# Altium project T20_DevBoard.PrjPcb (part 4 of 4)

## Sheet CONFIGURATION_STORAGE_USER_LEDS_BUTTONS.SchDoc: CONFIGURATION_&_STORAGE_&_USER_LEDS_BUTTONS
size 420 x 297 mm; DrawnBy: Orhun Dabak; Revision: 1.0; SheetNumber: 6; SheetTotal: 7
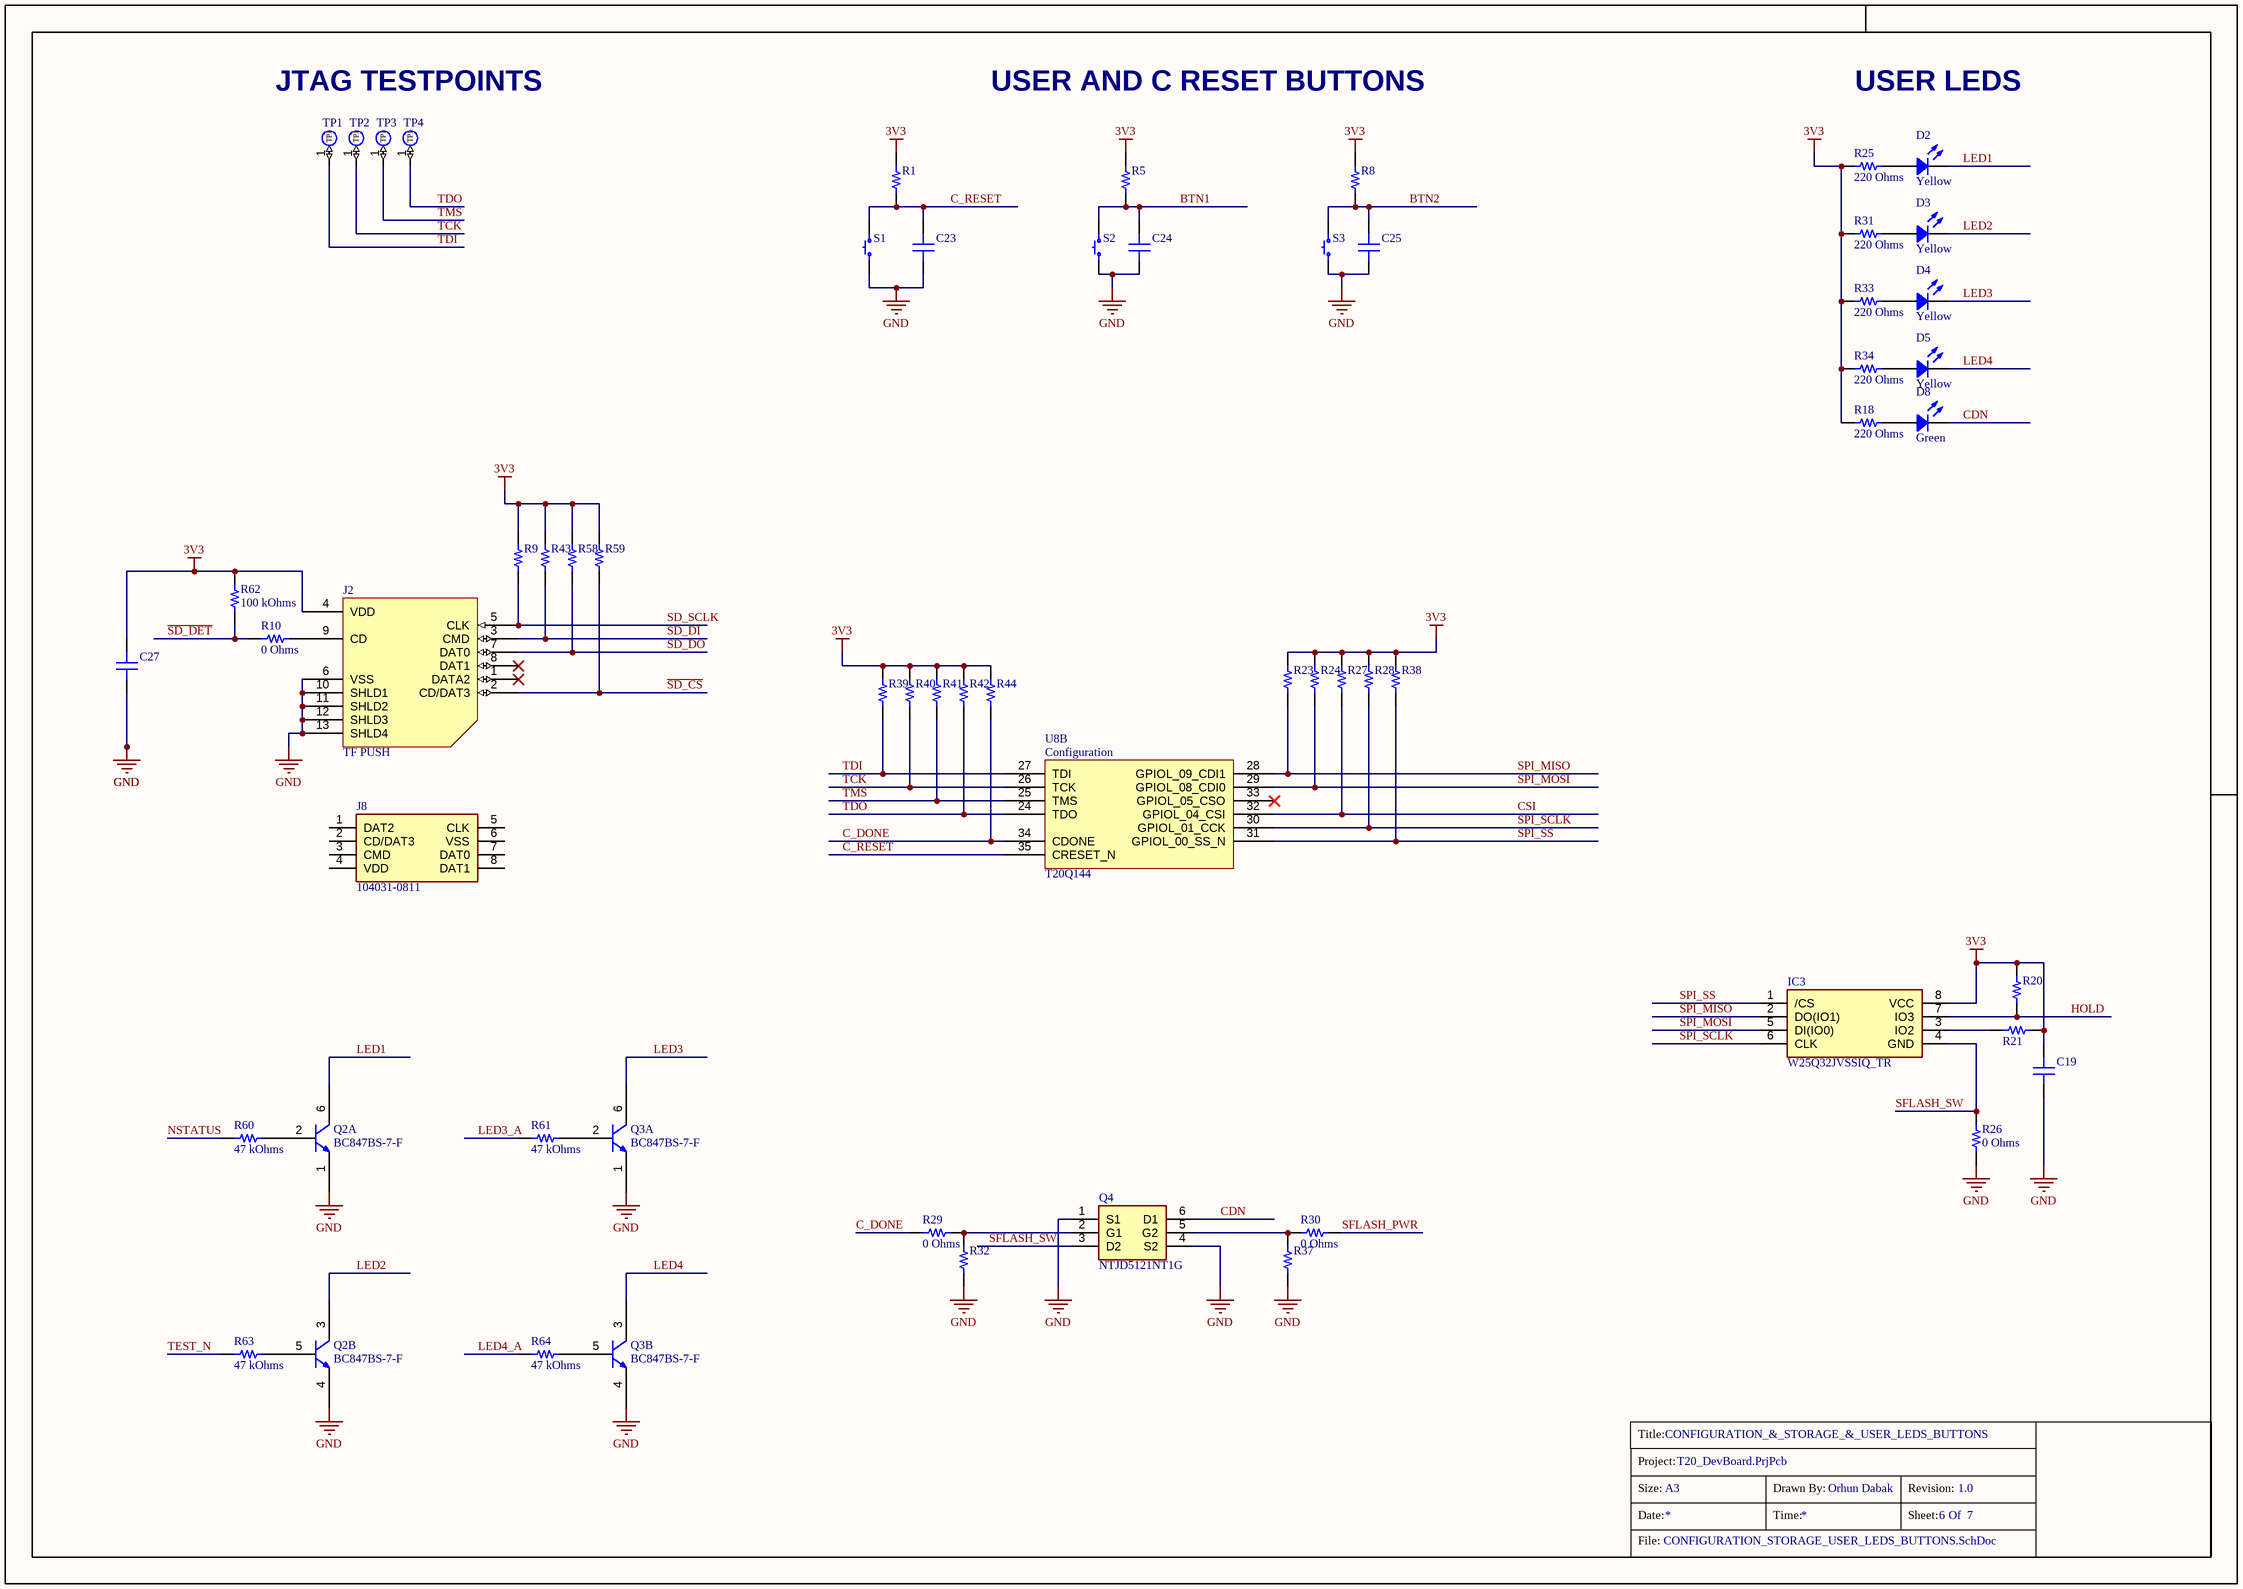
[diagram p5: CONFIGURATION_STORAGE_USER_LEDS_BUTTONS.SchDoc]

### Parts
(Parts that share a designator on the sheet are numbered #1, #2 ... from top to bottom, then left to right.)
?#5  (no value)  (graphical)
C19  0.1 µF  [CAP 0402_1005]  (value not drawn)
C23  10 µF  [CAP 0402_1005]  (value not drawn)
C24  10 µF  [CAP 0402_1005]  (value not drawn)
C25  10 µF  [CAP 0402_1005]  (value not drawn)
C27  0.1 µF  [CAP 0402_1005]  (value not drawn)
D2  Yellow  [LED 0603_1608 YELLOW]
D3  Yellow  [LED 0603_1608 YELLOW]
D4  Yellow  [LED 0603_1608 YELLOW]
D5  Yellow  [LED 0603_1608 YELLOW]
D8  Green  [LED 0603_1608 GREEN]
IC3  W25Q32JVSSIQ_TR  [SOIC127P790X216-8N]
J2  TF PUSH  [TF PUSH]
J8  104031-0811  [1040310811]
Q2  BC847BS-7-F  [BC847BS-7-F-Footprint-1]  (parts A,B of 2)
Q3  BC847BS-7-F  [BC847BS-7-F-Footprint-1]  (parts A,B of 2)
Q4  NTJD5121NT1G  [SOT65P210X110-6N]
R1  10 kOhms  [RES 0402_1005]  (value not drawn)
R5  10 kOhms  [RES 0402_1005]  (value not drawn)
R8  10 kOhms  [RES 0402_1005]  (value not drawn)
R9  10 kOhms  [RES 0402_1005]  (value not drawn)
R10  0 Ohms  [RES 0402_1005]
R18  220 Ohms  [RES 0402_1005]
R20  10 kOhms  [RES 0402_1005]  (value not drawn)
R21  10 kOhms  [RES 0402_1005]  (value not drawn)
R23  10 kOhms  [RES 0402_1005]  (value not drawn)
R24  10 kOhms  [RES 0402_1005]  (value not drawn)
R25  220 Ohms  [RES 0402_1005]
R26  0 Ohms  [RES 0402_1005]
R27  10 kOhms  [RES 0402_1005]  (value not drawn)
R28  10 kOhms  [RES 0402_1005]  (value not drawn)
R29  0 Ohms  [RES 0402_1005]
R30  0 Ohms  [RES 0402_1005]
R31  220 Ohms  [RES 0402_1005]
R32  10 kOhms  [RES 0402_1005]  (value not drawn)
R33  220 Ohms  [RES 0402_1005]
R34  220 Ohms  [RES 0402_1005]
R37  10 kOhms  [RES 0402_1005]  (value not drawn)
R38  10 kOhms  [RES 0402_1005]  (value not drawn)
R39  10 kOhms  [RES 0402_1005]  (value not drawn)
R40  10 kOhms  [RES 0402_1005]  (value not drawn)
R41  10 kOhms  [RES 0402_1005]  (value not drawn)
R42  10 kOhms  [RES 0402_1005]  (value not drawn)
R43  10 kOhms  [RES 0402_1005]  (value not drawn)
R44  10 kOhms  [RES 0402_1005]  (value not drawn)
R58  10 kOhms  [RES 0402_1005]  (value not drawn)
R59  10 kOhms  [RES 0402_1005]  (value not drawn)
R60  47 kOhms  [RES 0402_1005]
R61  47 kOhms  [RES 0402_1005]
R62  100 kOhms  [RES 0402_1005]
R63  47 kOhms  [RES 0402_1005]
R64  47 kOhms  [RES 0402_1005]
S1  TS342A2P-WZ  [TS342A2P-WZ]  (value not drawn)
S2  TS342A2P-WZ  [TS342A2P-WZ]  (value not drawn)
S3  TS342A2P-WZ  [TS342A2P-WZ]  (value not drawn)
TP1  TP_1  [TEST POINT]  (value not drawn)  (no BOM)
TP2  TP_1  [TEST POINT]  (value not drawn)  (no BOM)
TP3  TP_1  [TEST POINT]  (value not drawn)  (no BOM)
TP4  TP_1  [TEST POINT]  (value not drawn)  (no BOM)
U8  T20Q144  [CQFP50P2200X2200X160-144N]  (part B of 13)

### Nets
3V3: C19.2 C27.2 IC3.8(VCC) J2.4(VDD) R1.2 R5.2 R8.2 R9.2 R18.1 R20.2 R21.1 R23.2 R24.2 R25.1 R27.2 R28.2 R31.1 R33.1 R34.1 R38.2 R39.2 R40.2 R41.2 R42.2 R43.2 R44.2 R58.2 R59.2 R62.2
GND: C19.1 C23.1 C24.1 C25.1 C27.1 J2.6(VSS) J2.10(SHLD1) J2.11(SHLD2) J2.12(SHLD3) J2.13(SHLD4) Q2.1(Emitter) Q2.4(Emitter) Q3.1(Emitter) Q3.4(Emitter) Q4.1(S1) Q4.4(S2) R26.1 R32.1 R37.1 S1.1 S2.1 S3.1
BTN1: C24.2 R5.1 S2.2
BTN2: C25.2 R8.1 S3.2
C_DONE: R29.1 R44.1 U8.34(CDONE)
C_RESET: C23.2 R1.1 S1.2 U8.35(CRESET_N)
CDN: D8.2 Q4.6(D1)
CSI: R27.1 U8.32(GPIOL_04_CSI)
HOLD: IC3.7(IO3) R20.1
LED1: D2.2 Q2.6(Collector)
LED2: D3.2 Q2.3(Collector)
LED3: D4.2 Q3.6(Collector)
LED3_A: R61.1
LED4: D5.2 Q3.3(Collector)
LED4_A: R64.1
NSTATUS: R60.1
~{SD_CS}: J2.2(CD/DAT3) R59.1
~{SD_DET}: R10.1 R62.1
SD_DI: J2.3(CMD) R43.1
SD_DO: J2.7(DAT0) R58.1
SD_SCLK: J2.5(CLK) R9.1
SFLASH_PWR: R30.2
SFLASH_SW: IC3.4(GND) Q4.3(D2) R26.2
SPI_MISO: IC3.2(DO(IO1)) R23.1 U8.28(GPIOL_09_CDI1)
SPI_MOSI: IC3.5(DI(IO0)) R24.1 U8.29(GPIOL_08_CDI0)
SPI_SCLK: IC3.6(CLK) R28.1 U8.30(GPIOL_01_CCK)
SPI_SS: IC3.1(/CS) R38.1 U8.31(GPIOL_00_SS_N)
TCK: R40.1 TP2.1(TP1) U8.26(TCK)
TDI: R39.1 TP1.1(TP1) U8.27(TDI)
TDO: R42.1 TP4.1(TP1) U8.24(TDO)
TEST_N: R63.1
TMS: R41.1 TP3.1(TP1) U8.25(TMS)
NetD2_1: D2.1 R25.2
NetD3_1: D3.1 R31.2
NetD4_1: D4.1 R33.2
NetD5_1: D5.1 R34.2
NetD8_1: D8.1 R18.2
NetIC3_3: IC3.3(IO2) R21.2
NetJ2_9: J2.9(CD) R10.2
NetQ2_2: Q2.2(Base) R60.2
NetQ2_5: Q2.5(Base) R63.2
NetQ3_2: Q3.2(Base) R61.2
NetQ3_5: Q3.5(Base) R64.2
NetQ4_2: Q4.2(G1) R29.2 R32.2
NetQ4_5: Q4.5(G2) R30.1 R37.2

Not connected (* = marked no-connect by the designer): J2 1(DATA2)* 8(DAT1)*; J8 1(DAT2) 2(CD/DAT3) 3(CMD) 4(VDD) 5(CLK) 6(VSS) 7(DAT0) 8(DAT1); U8 33(GPIOL_05_CSO)*

### Notes on the sheet
- JTAG TESTPOINTS
- USER AND C RESET BUTTONS
- USER LEDS
- Title:
- Project:
- Size:
- Date:
- File:
- A3
- Time:
- Drawn By:
- Sheet:
- Revision:
- Of
- (in symbol T20Q144, part B) Configuration

### Library data of the parts
?#5 = Title_Block
C19 C27 = CC0402KRX7R6BB104: CAP CER 0.1UF 10V X7R 0402; manufacturer: Yageo; Tolerance: ±10%; Part Number: CC0402KRX7R6BB104; Value: 0.1 µF; Applications: General Purpose; Capacitance: 0.1 µF; componentlink1description: Datasheet; componentlink1url: https://www.yageo.com/upload/media/product/productsearch/datasheet/mlcc/UPY-GPHC_X7R_6.3V-to-50V_18.pdf; componentlink2description: DigiKey Link; componentlink2url: https://www.digikey.com/en/products/detail/yageo/CC0402KRX7R6BB104/2103083; Device Package: 0402 (1005 Metric); lastupdated: 19/09/2022 12:57:28; Lifecycle Status: Active; Minimum Order: 1; Mounting Type: Surface Mount, MLCC; Operating Temperature: -55°C ~ 125°C; Package / Case: 0402 (1005 Metric); packaging: CutTape; partid: 3877; Part Status: Active; price: 0.01; series: CC; Size / Dimension: 0.039" L x 0.020" W (1.00mm x 0.50mm); Supplier 1: DigiKey; Supplier Part Number 1: 311-1345-1-ND; Temperature Coefficient: X7R; Thickness (Max): 0.022" (0.55mm); Voltage - Rated: 10V
C23-C25 = GRM155R61A106ME11D: CAP CER 10UF 10V X5R 0402; manufacturer: Murata Electronics; Tolerance: ±20%; Part Number: GRM155R61A106ME11D; Value: 10 µF; Applications: General Purpose; Capacitance: 10 µF; componentlink2description: DigiKey Link; componentlink2url: https://www.digikey.com/en/products/detail/murata-electronics/GRM155R61A106ME11D/12091056; Device Package: 0402 (1005 Metric); lastupdated: 19/09/2022 12:56:37; Lifecycle Status: Active; Minimum Order: 1; Mounting Type: Surface Mount, MLCC; Operating Temperature: -55°C ~ 85°C; Package / Case: 0402 (1005 Metric); packaging: TapeAndReel; partid: 45464; Part Status: Active; price: 0.02; series: GRM; Size / Dimension: 0.039" L x 0.020" W (1.00mm x 0.50mm); Supplier 1: DigiKey; Supplier Part Number 1: 490-GRM155R61A106ME11DCT-ND; Temperature Coefficient: X5R; Thickness (Max): 0.028" (0.70mm); Voltage - Rated: 10V
D2-D5 = SML-LX0603YW-TR: LED YELLOW DIFFUSED SMD; Manufacturer: Lumex Opto/Components Inc.; Configuration: Standard; Current - Test: 20mA; Lens Color: White; Lens Size: 1.00mm x 0.80mm; Lens Style: Rectangle with Flat Top; Millicandela Rating: 14mcd; Viewing Angle: 160°; Voltage - Forward (Vf) (Typ): 2.1V; Wavelength - Peak: 585nm; Part Number: SML-LX0603YW-TR; Color: Yellow; ComponentLink1Description: Datasheet; ComponentLink1URL: https://www.lumex.com/content/files/ProductAttachment/SML-LX0603YW-TR.pdf; ComponentLink2Description: DigiKey Link; ComponentLink2URL: https://www.digikey.com/en/products/detail/lumex-opto-components-inc/SML-LX0603YW-TR/304361; Device Package: 0603 (1608 Metric); Height (Max): 0.60mm; LastUpdated: 19/09/2022 13:51:05; Lens Transparency: Diffused; Lifecycle Status: Active; Minimum Order: 1; Mounting Type: Surface Mount; Package / Case: 0603 (1608 Metric); Packaging: TapeAndReel; PartId: 92; Part Status: Active; Price: 0.05; Series: -; Size / Dimension: 1.60mm L x 0.80mm W; Supplier 1: DigiKey; Supplier Part Number 1: 67-1550-1-ND; Value: Yellow
D8 = LSM0603453V: LED SM 0603 3V -/1000/-MCD GREEN; Manufacturer: Visual Communications Company - VCC; Configuration: Standard; Current - Test: 20mA; Lens Color: Colorless; Lens Size: 1.20mm x 0.80mm; Lens Style: Rectangle with Flat Top; Lens Transparency: Clear; Millicandela Rating: 63mcd; Viewing Angle: 120°; Voltage - Forward (Vf) (Typ): 2V; Wavelength - Dominant: 572nm; Wavelength - Peak: 571nm; Part Number: LSM0603453V; Color: Green; ComponentLink1Description: Datasheet; ComponentLink1URL: https://vcclite.com/wp-content/uploads/wpallimport/files/files/LSM0603453V.pdf; ComponentLink2Description: DigiKey Link; ComponentLink2URL: https://www.digikey.com/en/products/detail/visual-communications-company-vcc/LSM0603453V/9486724; Device Package: 0603 (1608 Metric); Height (Max): 0.65mm; LastUpdated: 19/09/2022 13:49:59; Lifecycle Status: Active; Minimum Order: 1; Mounting Type: Surface Mount; Package / Case: 0603 (1608 Metric); Packaging: TapeAndReel; PartId: 579; Part Status: Active; Price: 0.05; Series: LSM0603; Size / Dimension: 1.60mm L x 0.80mm W; Supplier 1: DigiKey; Supplier Part Number 1: LSM0603453VCT-ND; Supplier Device Package: Chip LED; Value: Green
IC3 = W25Q32JVSSIQ_TR: Integrated Circuit; Manufacturer_Name: Winbond; Manufacturer_Part_Number: W25Q32JVSSIQ TR; Datasheet Link: https://www.winbond.com/resource-files/w25q32jv%20spi%20revc%2008302016.pdf; Height: 2.16mm; Mouser Part Number: 454-W25Q32JVSSIQTR; Mouser Price/Stock: https://www.mouser.co.uk/ProductDetail/Winbond/W25Q32JVSSIQ-TR?qs=qSfuJ%252Bfl%2Fd73AdQzQa%2FEuA%3D%3D; Arrow Part Number: W25Q32JVSSIQ TR; Arrow Price/Stock: https://www.arrow.com/en/products/w25q32jvssiqtr/winbond-electronics?region=nac
J2 = TF PUSH: -20℃~+90℃ 2mm Deck MicroSD card (TF card) Self bomb SMD SD Card Connectors ROHS; Manufacturer: SHOU HAN; ComponentLink1Description: Datasheet; ComponentLink1URL: https://datasheet.lcsc.com/lcsc/1912111437_SHOU-HAN-TF-PUSH_C393941.pdf; ComponentLink2Description: LCSC Link; ComponentLink2URL: https://www.lcsc.com/product-detail/SD-Card-Connectors_SHOU-HAN-TF-PUSH_C393941.html; Manufacturer Part Number: TF PUSH; LCSC Part Number: C393941; Package: SMD; Category: Connectors/SD Card Connectors; Operating Temperature Range: -20℃~+90℃; Maximum Body Height: 2mm; Connector Type: Deck; Card Type: MicroSD card (TF card); Card Connection Mode: Self bomb
J8 = 104031-0811: Connector; Manufacturer_Name: Molex; Datasheet Link: http://www.molex.com/webdocs/datasheets/pdf/en-us/1040310811_MEMORY_CARD_SOCKET.pdf; Manufacturer_Part_Number: 104031-0811; Mouser Part Number: 538-104031-0811; Mouser Price/Stock: https://www.mouser.co.uk/ProductDetail/Molex/104031-0811?qs=udsGRKD4nA3Tvy7wqky%252BuA%3D%3D
Q2 Q3 = CMP-013-00035-3: 2NPN Ic=100mA Vceo=45V hfe=200~450 P=200mW SOT363
Q4 = NTJD5121NT1G: Transistor; Manufacturer_Name: onsemi; Datasheet Link: http://www.onsemi.com/pub/Collateral/NTJD5121N-D.PDF; Height: 1.1mm; Manufacturer_Part_Number: NTJD5121NT1G; Mouser Part Number: 863-NTJD5121NT1G; Mouser Price/Stock: https://www.mouser.co.uk/ProductDetail/onsemi/NTJD5121NT1G?qs=E94NKttrCwxgtZwNB18zeg%3D%3D; Arrow Part Number: NTJD5121NT1G; Arrow Price/Stock: https://www.arrow.com/en/products/ntjd5121nt1g/on-semiconductor?region=nac
R1 R5 R8 R9 R20 R21 R23 R24 R27 R28 R32 R37-R44 R58 R59 = RP73PF1E10KBTD: RES 10K OHM 0.1% 1/10W 0402; Manufacturer: TE Connectivity Passive Product; Power (Watts): 0.1W, 1/10W; Temperature Coefficient: ±25ppm/°C; Part Number: RP73PF1E10KBTD; Value: 10 kOhms; ComponentLink1Description: Datasheet; ComponentLink1URL: https://www.te.com/commerce/DocumentDelivery/DDEController?Action=srchrtrv&DocNm=1773272&DocType=DS&DocLang=English; ComponentLink2Description: DigiKey Link; ComponentLink2URL: https://www.digikey.com/en/products/detail/te-connectivity-passive-product/RP73PF1E10KBTD/8260957; Composition: Thin Film; Device Package: 0402 (1005 Metric); Height - Seated (Max): 0.014" (0.35mm); LastUpdated: 9/19/2022 01:15:04 PM; Lifecycle Status: Active; Minimum Order: 1; Number of Terminations: 2; Operating Temperature: -55°C ~ 155°C; Package / Case: 0402 (1005 Metric); Packaging: TapeAndReel; PartId: 2434; Part Status: Active; Price: 0.09; Resistance: 10 kOhms; Series: RP73, Holsworthy; Size / Dimension: 0.039" L x 0.020" W (1.00mm x 0.50mm); Supplier 1: DigiKey; Supplier Part Number 1: A127415CT-ND; Supplier Device Package: 0402; Tolerance: ±0.1%
R10 R26 R29 R30 = RC0402JR-070RL: RES 0 OHM JUMPER 1/16W 0402; Manufacturer: Yageo; Power (Watts): 0.063W, 1/16W; Part Number: RC0402JR-070RL; Value: 0 Ohms; ComponentLink1Description: Datasheet; ComponentLink1URL: https://www.yageo.com/upload/media/product/productsearch/datasheet/rchip/PYu-RC_Group_51_RoHS_L_10.pdf; ComponentLink2Description: DigiKey Link; ComponentLink2URL: https://www.digikey.com/en/products/detail/yageo/RC0402JR-070RL/726406; Composition: Thick Film; Device Package: 0402 (1005 Metric); Features: Moisture Resistant; Height - Seated (Max): 0.016" (0.40mm); LastUpdated: 1/2/2023 08:20:46 PM; Lifecycle Status: Active; Minimum Order: 1; Number of Terminations: 2; Operating Temperature: -55°C ~ 155°C; Package / Case: 0402 (1005 Metric); Packaging: CutTape; PartId: 17588; Part Status: Active; Price: 0.01; Resistance: 0 Ohms; Series: RC_L; Size / Dimension: 0.039" L x 0.020" W (1.00mm x 0.50mm); Supplier 1: DigiKey; Supplier Part Number 1: 311-0.0JRCT-ND; Supplier Device Package: 0402; Tolerance: Jumper
R18 R25 R31 R33 R34 = RC0402FR-07220RL: RES 220 OHM 1% 1/16W 0402; Manufacturer: Yageo; Power (Watts): 0.063W, 1/16W; Temperature Coefficient: ±100ppm/°C; Part Number: RC0402FR-07220RL; Value: 220 Ohms; ComponentLink1Description: Datasheet; ComponentLink1URL: https://www.yageo.com/upload/media/product/productsearch/datasheet/rchip/PYu-RC_Group_51_RoHS_L_10.pdf; ComponentLink2Description: DigiKey Link; ComponentLink2URL: https://www.digikey.com/en/products/detail/yageo/RC0402FR-07220RL/726565; Composition: Thick Film; Device Package: 0402 (1005 Metric); Features: Moisture Resistant; Height - Seated (Max): 0.016" (0.40mm); LastUpdated: 19/09/2022 13:14:14; Lifecycle Status: Active; Minimum Order: 1; Number of Terminations: 2; Operating Temperature: -55°C ~ 155°C; Package / Case: 0402 (1005 Metric); Packaging: CutTape; PartId: 17956; Part Status: Active; Price: 0.01; Resistance: 220 Ohms; Series: RC_L; Size / Dimension: 0.039" L x 0.020" W (1.00mm x 0.50mm); Supplier 1: DigiKey; Supplier Part Number 1: 311-220LRCT-ND; Supplier Device Package: 0402; Tolerance: ±1%
R60 R61 R63 R64 = RMCF0402FT47K0: RES 47K OHM 1% 1/16W 0402; Manufacturer: Stackpole Electronics Inc; Power (Watts): 0.063W, 1/16W; Temperature Coefficient: ±100ppm/°C; Part Number: RMCF0402FT47K0; Value: 47 kOhms; ComponentLink1Description: Datasheet; ComponentLink1URL: https://www.seielect.com/catalog/sei-rmcf_rmcp.pdf; ComponentLink2Description: DigiKey Link; ComponentLink2URL: https://www.digikey.com/en/products/detail/stackpole-electronics-inc/RMCF0402FT47K0/1714749; Composition: Thick Film; Device Package: 0402 (1005 Metric); Features: Automotive AEC-Q200; Height - Seated (Max): 0.016" (0.40mm); LastUpdated: 1/2/2023 08:21:41 PM; Lifecycle Status: Active; Minimum Order: 1; Number of Terminations: 2; Operating Temperature: -55°C ~ 155°C; Package / Case: 0402 (1005 Metric); Packaging: CutTape; PartId: 4957; Part Status: Active; Price: 0.01; Ratings: AEC-Q200; Resistance: 47 kOhms; Series: RMCF; Size / Dimension: 0.039" L x 0.020" W (1.00mm x 0.50mm); Supplier 1: DigiKey; Supplier Part Number 1: RMCF0402FT47K0CT-ND; Supplier Device Package: 0402; Tolerance: ±1%
R62 = RT0402FRE07100KL: RES SMD 100K OHM 1% 1/16W 0402; Manufacturer: Yageo; Power (Watts): 0.063W, 1/16W; Temperature Coefficient: ±50ppm/°C; Part Number: RT0402FRE07100KL; Value: 100 kOhms; ComponentLink1Description: Datasheet; ComponentLink1URL: https://www.yageo.com/upload/media/product/productsearch/datasheet/rchip/PYu-RT_1-to-0.01_RoHS_L_11.pdf; ComponentLink2Description: DigiKey Link; ComponentLink2URL: https://www.digikey.com/en/products/detail/yageo/RT0402FRE07100KL/1071698; Composition: Thin Film; Device Package: 0402 (1005 Metric); Height - Seated (Max): 0.014" (0.35mm); LastUpdated: 1/2/2023 08:21:49 PM; Lifecycle Status: Active; Minimum Order: 1; Number of Terminations: 2; Operating Temperature: -55°C ~ 155°C; Package / Case: 0402 (1005 Metric); Packaging: TapeAndReel; PartId: 3190; Part Status: Active; Price: 0.01; Resistance: 100 kOhms; Series: RT; Size / Dimension: 0.039" L x 0.020" W (1.00mm x 0.50mm); Supplier 1: DigiKey; Supplier Part Number 1: YAG2307CT-ND; Supplier Device Package: 0402; Tolerance: ±1%
S1-S3 = TS342A2P-WZ: NO SMDSplicing 50mA 3.95mm 100MΩ 30000 12V 2.9mm -25℃~+70℃ 2mm Black Round Button Brick nogging SPST SMD Tactile Switches ROHS; Manufacturer: SHOU HAN; Mechanical Life: 30000; ComponentLink1Description: Datasheet; ComponentLink1URL: https://datasheet.lcsc.com/lcsc/2005221232_SHOU-HAN-TS342A2P-WZ_C557591.pdf; ComponentLink2Description: LCSC Link; ComponentLink2URL: https://www.lcsc.com/product-detail/Tactile-Switches_SHOU-HAN-TS342A2P-WZ_C557591.html; Manufacturer Part Number: TS342A2P-WZ; JLCPCB Part Number: C557591; Package: SMD; Contact Current: 50mA; Switch Length: 3.95mm; Insulation Resistance: 100MΩ; Voltage Rating (DC): 12V; Switch Width: 2.9mm; Actuator/Cap Color: Black; Actuator Style: Round Button; Mounting Style: Brick nogging; Circuit: SPST
TP1-TP4 = TEST POINT_1(I/O): 1.5x1.5mm Test Point(I/O)
U8 = T20Q144: Trion® Field Programmable Gate Array (FPGA) IC 97 1044 19728 144-LQFP

## Sheet FPGA_GPIO.SchDoc: ARDUINO_SYZGY
size 420 x 297 mm; DrawnBy: Orhun Dabak; Revision: 1.0; SheetNumber: 7; SheetTotal: 7
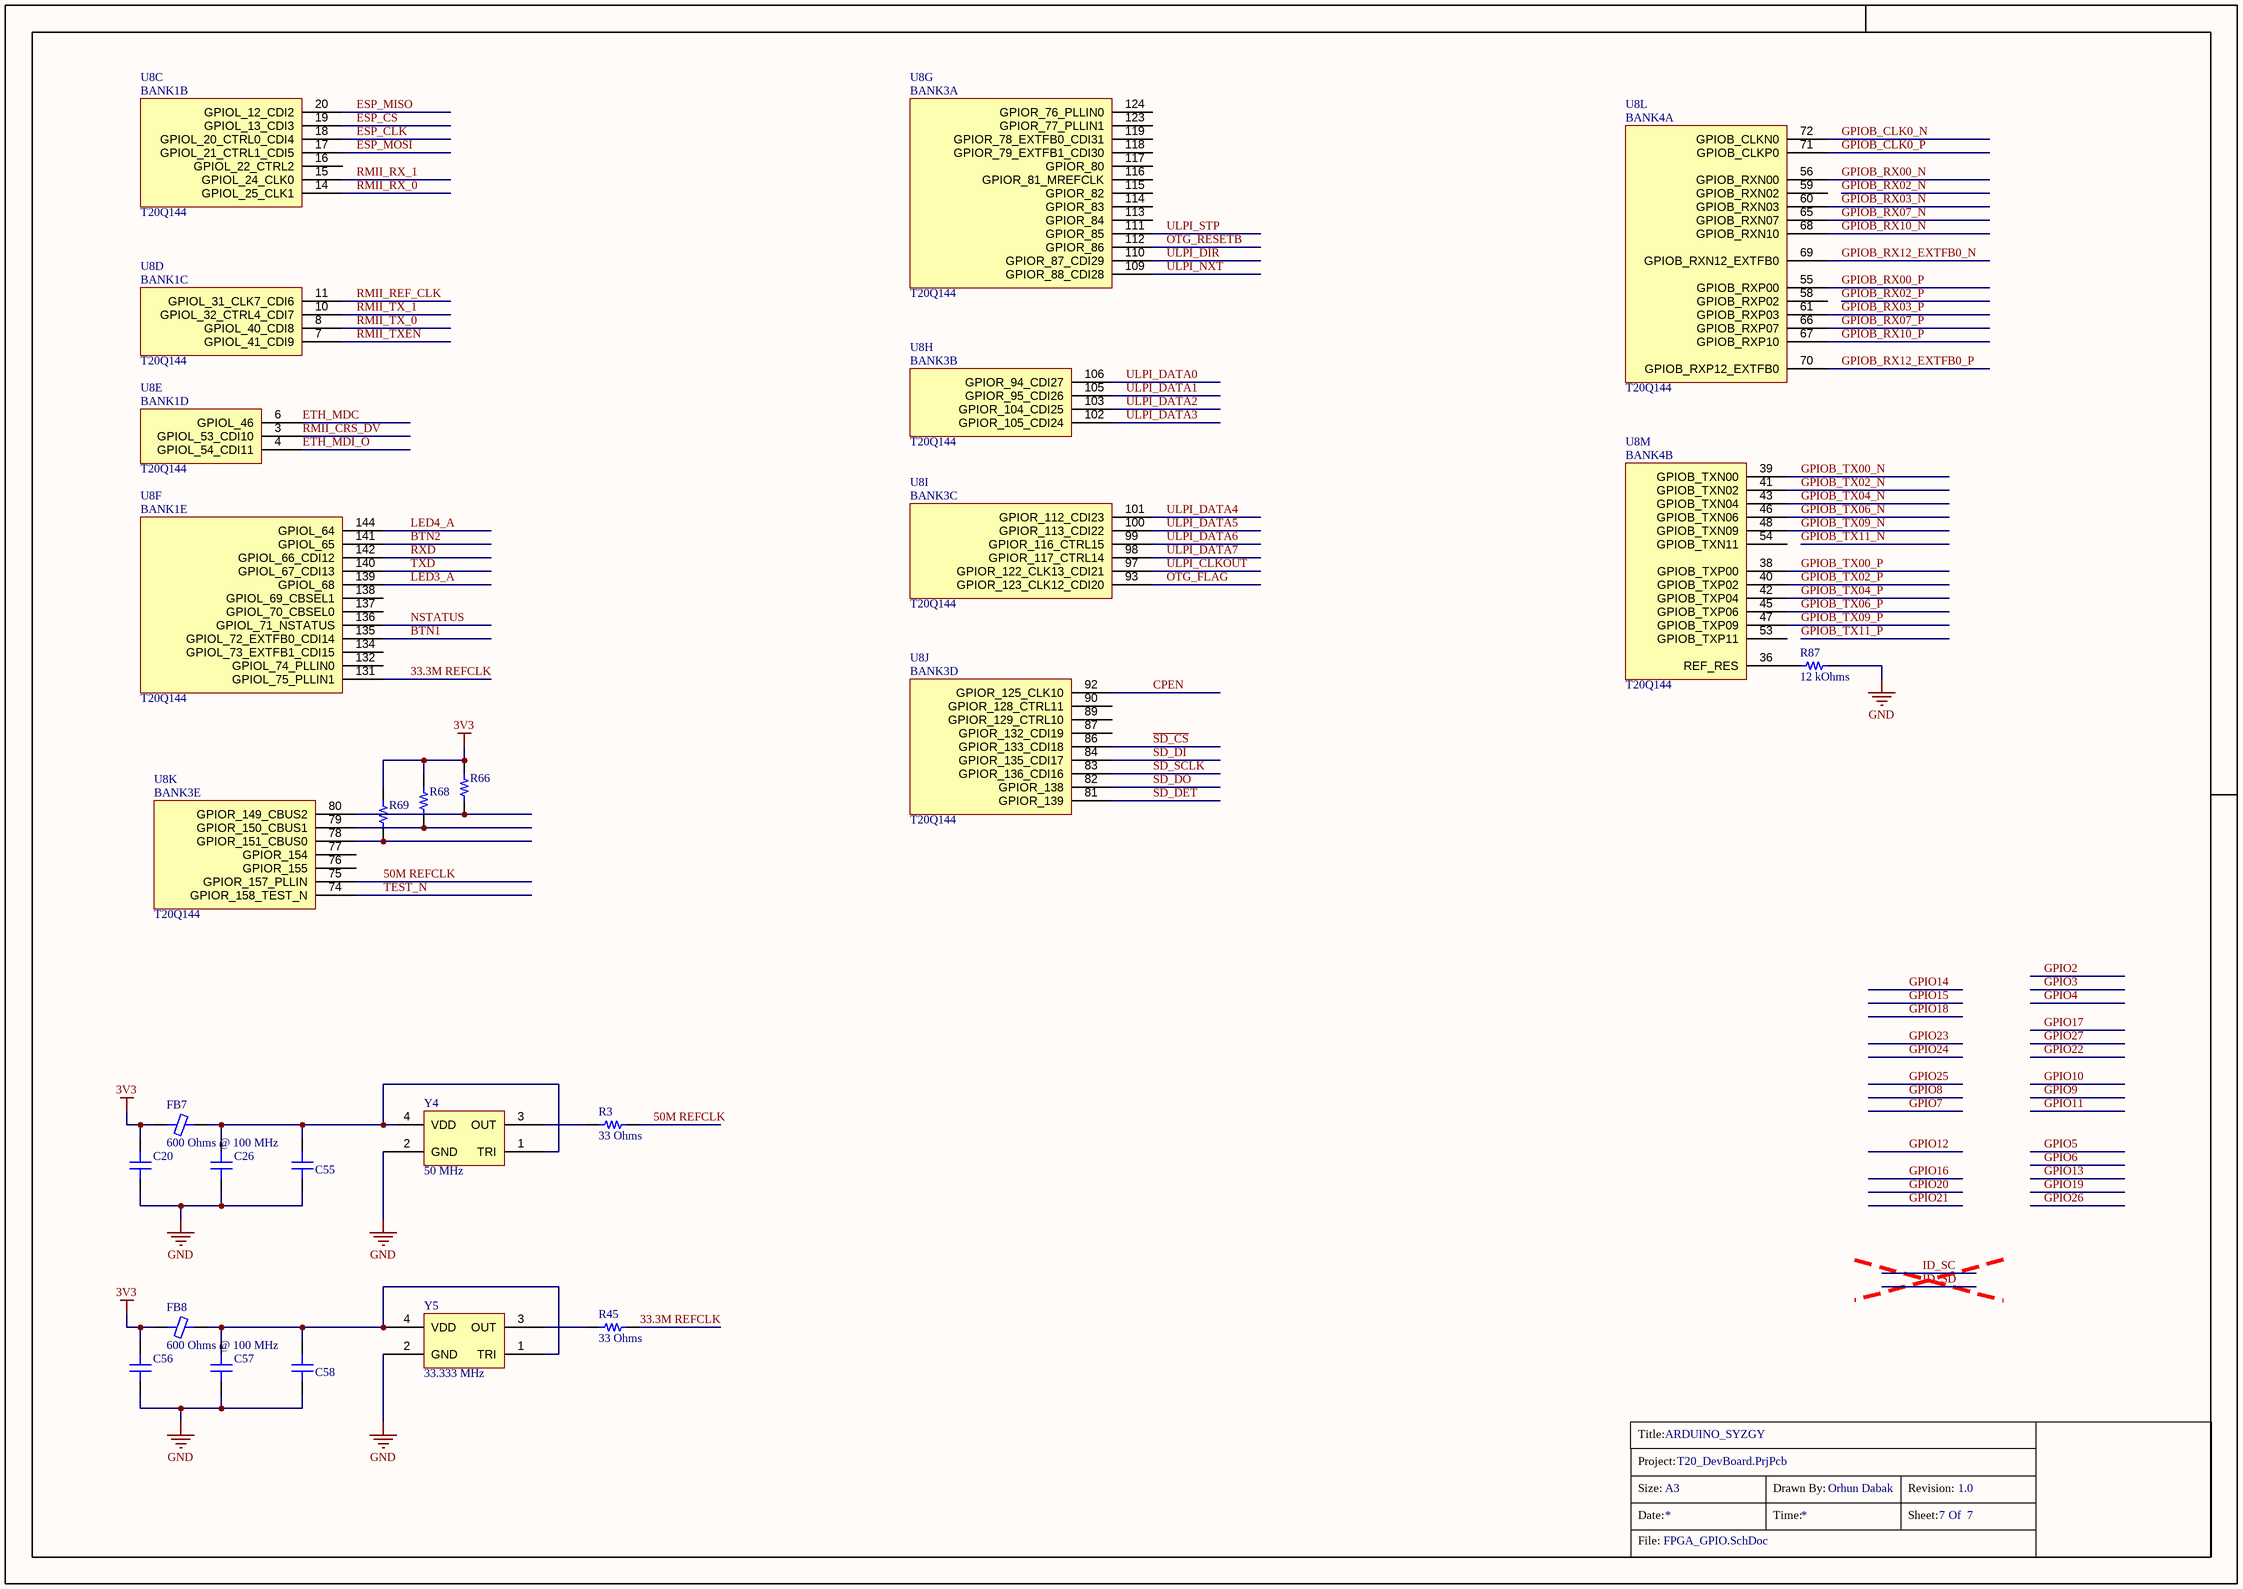
[diagram p6: FPGA_GPIO.SchDoc]

### Parts
(Parts that share a designator on the sheet are numbered #1, #2 ... from top to bottom, then left to right.)
?#6  (no value)  (graphical)
C20  4.7 µF  [CAP 0402_1005]  (value not drawn)
C26  4.7 µF  [CAP 0402_1005]  (value not drawn)
C55  10000 pF  [CAP 0402_1005]  (value not drawn)
C56  4.7 µF  [CAP 0402_1005]  (value not drawn)
C57  4.7 µF  [CAP 0402_1005]  (value not drawn)
C58  10000 pF  [CAP 0402_1005]  (value not drawn)
FB7  600 Ohms @ 100 MHz  [FER 0402_1005]
FB8  600 Ohms @ 100 MHz  [FER 0402_1005]
R3  33 Ohms  [RES 0402_1005]
R45  33 Ohms  [RES 0402_1005]
R66  10 kOhms  [RES 0402_1005]  (value not drawn)
R68  10 kOhms  [RES 0402_1005]  (value not drawn)
R69  10 kOhms  [RES 0402_1005]  (value not drawn)
R87  12 kOhms  [RES 0402_1005]
U8  T20Q144  [CQFP50P2200X2200X160-144N]  (parts C,D,E,F,G,H,I,J,K,L,M of 13)
Y4  50 MHz  [ABRACON ASE]
Y5  33.333 MHz  [ABRACON ASE]

### Nets
3V3: C20.2 C56.2 FB7.1 FB8.1 R66.2 R68.2 R69.2
GND: C20.1 C26.1 C55.1 C56.1 C57.1 C58.1 R87.2 Y4.2(GND) Y5.2(GND)
33.3M REFCLK: R45.2 U8.131(GPIOL_75_PLLIN1)
50M REFCLK: R3.2 U8.75(GPIOR_157_PLLIN)
BTN1: U8.135(GPIOL_72_EXTFB0_CDI14)
BTN2: U8.141(GPIOL_65)
CPEN: U8.92(GPIOR_125_CLK10)
ESP_CLK: U8.18(GPIOL_20_CTRL0_CDI4)
ESP_CS: U8.19(GPIOL_13_CDI3)
ESP_MISO: U8.20(GPIOL_12_CDI2)
ESP_MOSI: U8.17(GPIOL_21_CTRL1_CDI5)
ETH_MDC: U8.6(GPIOL_46)
ETH_MDI_O: U8.4(GPIOL_54_CDI11)
GPIOB_CLK0_N: U8.72(GPIOB_CLKN0)
GPIOB_CLK0_P: U8.71(GPIOB_CLKP0)
GPIOB_RX00_N: U8.56(GPIOB_RXN00)
GPIOB_RX00_P: U8.55(GPIOB_RXP00)
GPIOB_RX03_N: U8.60(GPIOB_RXN03)
GPIOB_RX03_P: U8.61(GPIOB_RXP03)
GPIOB_RX07_N: U8.65(GPIOB_RXN07)
GPIOB_RX07_P: U8.66(GPIOB_RXP07)
GPIOB_RX10_N: U8.68(GPIOB_RXN10)
GPIOB_RX10_P: U8.67(GPIOB_RXP10)
GPIOB_RX12_EXTFB0_N: U8.69(GPIOB_RXN12_EXTFB0)
GPIOB_RX12_EXTFB0_P: U8.70(GPIOB_RXP12_EXTFB0)
GPIOB_TX00_N: U8.39(GPIOB_TXN00)
GPIOB_TX00_P: U8.38(GPIOB_TXP00)
GPIOB_TX02_N: U8.41(GPIOB_TXN02)
GPIOB_TX02_P: U8.40(GPIOB_TXP02)
GPIOB_TX04_N: U8.43(GPIOB_TXN04)
GPIOB_TX04_P: U8.42(GPIOB_TXP04)
GPIOB_TX06_N: U8.46(GPIOB_TXN06)
GPIOB_TX06_P: U8.45(GPIOB_TXP06)
GPIOB_TX09_N: U8.48(GPIOB_TXN09)
GPIOB_TX09_P: U8.47(GPIOB_TXP09)
LED3_A: U8.139(GPIOL_68)
LED4_A: U8.144(GPIOL_64)
NSTATUS: U8.136(GPIOL_71_NSTATUS)
OTG_FLAG: U8.93(GPIOR_123_CLK12_CDI20)
OTG_RESETB: U8.112(GPIOR_86)
RMII_CRS_DV: U8.3(GPIOL_53_CDI10)
RMII_REF_CLK: U8.11(GPIOL_31_CLK7_CDI6)
RMII_RX_0: U8.14(GPIOL_25_CLK1)
RMII_RX_1: U8.15(GPIOL_24_CLK0)
RMII_TX_0: U8.8(GPIOL_40_CDI8)
RMII_TX_1: U8.10(GPIOL_32_CTRL4_CDI7)
RMII_TXEN: U8.7(GPIOL_41_CDI9)
RXD: U8.142(GPIOL_66_CDI12)
~{SD_CS}: U8.86(GPIOR_133_CDI18)
~{SD_DET}: U8.81(GPIOR_139)
SD_DI: U8.84(GPIOR_135_CDI17)
SD_DO: U8.82(GPIOR_138)
SD_SCLK: U8.83(GPIOR_136_CDI16)
TEST_N: U8.74(GPIOR_158_TEST_N)
TXD: U8.140(GPIOL_67_CDI13)
ULPI_CLKOUT: U8.97(GPIOR_122_CLK13_CDI21)
ULPI_DATA0: U8.106(GPIOR_94_CDI27)
ULPI_DATA1: U8.105(GPIOR_95_CDI26)
ULPI_DATA2: U8.103(GPIOR_104_CDI25)
ULPI_DATA3: U8.102(GPIOR_105_CDI24)
ULPI_DATA4: U8.101(GPIOR_112_CDI23)
ULPI_DATA5: U8.100(GPIOR_113_CDI22)
ULPI_DATA6: U8.99(GPIOR_116_CTRL15)
ULPI_DATA7: U8.98(GPIOR_117_CTRL14)
ULPI_DIR: U8.110(GPIOR_87_CDI29)
ULPI_NXT: U8.109(GPIOR_88_CDI28)
ULPI_STP: U8.111(GPIOR_85)
NetC26_2: C26.2 C55.2 FB7.2 Y4.1(TRI) Y4.4(VDD)
NetC57_2: C57.2 C58.2 FB8.2 Y5.1(TRI) Y5.4(VDD)
NetR3_1: R3.1 Y4.3(OUT)
NetR45_1: R45.1 Y5.3(OUT)
NetR66_1: R66.1 U8.80(GPIOR_149_CBUS2)
NetR68_1: R68.1 U8.79(GPIOR_150_CBUS1)
NetR69_1: R69.1 U8.78(GPIOR_151_CBUS0)
NetR87_1: R87.1 U8.36(REF_RES)

Not connected (* = marked no-connect by the designer): U8 16(GPIOL_22_CTRL2) 53(GPIOB_TXP11) 54(GPIOB_TXN11) 58(GPIOB_RXP02) 59(GPIOB_RXN02) 76(GPIOR_155) 77(GPIOR_154) 87(GPIOR_132_CDI19) 89(GPIOR_129_CTRL10) 90(GPIOR_128_CTRL11) 113(GPIOR_84) 114(GPIOR_83) 115(GPIOR_82) 116(GPIOR_81_MREFCLK) 117(GPIOR_80) 118(GPIOR_79_EXTFB1_CDI30) 119(GPIOR_78_EXTFB0_CDI31) 123(GPIOR_77_PLLIN1) 124(GPIOR_76_PLLIN0) 132(GPIOL_74_PLLIN0) 134(GPIOL_73_EXTFB1_CDI15) 137(GPIOL_70_CBSEL0) 138(GPIOL_69_CBSEL1)

### Notes on the sheet
- Title:
- Project:
- Size:
- Date:
- File:
- A3
- Time:
- Drawn By:
- Sheet:
- Revision:
- Of
- (in symbol T20Q144, part C) BANK1B
- (in symbol T20Q144, part D) BANK1C
- (in symbol T20Q144, part E) BANK1D
- (in symbol T20Q144, part F) BANK1E
- (in symbol T20Q144, part G) BANK3A
- (in symbol T20Q144, part H) BANK3B
- (in symbol T20Q144, part I) BANK3C
- (in symbol T20Q144, part J) BANK3D
- (in symbol T20Q144, part K) BANK3E
- (in symbol T20Q144, part L) BANK4A
- (in symbol T20Q144, part M) BANK4B

### Library data of the parts
?#6 = Title_Block
C20 C26 C56 C57 = CL05A475MP5NRNC: CAP CER 4.7UF 10V X5R 0402; manufacturer: Samsung Electro-Mechanics; Tolerance: ±20%; Part Number: CL05A475MP5NRNC; Value: 4.7 µF; Applications: General Purpose; Capacitance: 4.7 µF; componentlink1description: Datasheet; componentlink1url: http://www.samsungsem.com/kr/support/product-search/mlcc/CL05A475MP5NRNC.jsp; componentlink2description: DigiKey Link; componentlink2url: https://www.digikey.com/en/products/detail/samsung-electro-mechanics/CL05A475MP5NRNC/3887140; Device Package: 0402 (1005 Metric); lastupdated: 19/09/2022 12:57:17; Lifecycle Status: Active; Minimum Order: 1; Mounting Type: Surface Mount, MLCC; Operating Temperature: -55°C ~ 85°C; Package / Case: 0402 (1005 Metric); packaging: TapeAndReel; partid: 7650; Part Status: Active; price: 0.01; series: CL; Size / Dimension: 0.039" L x 0.020" W (1.00mm x 0.50mm); Supplier 1: DigiKey; Supplier Part Number 1: 1276-1482-1-ND; Temperature Coefficient: X5R; Thickness (Max): 0.022" (0.55mm); Voltage - Rated: 10V
C55 C58 = C0402C103K5RECAUTO: CAP CER 0402 10NF 50V X7R 10%; manufacturer: KEMET; Part Number: C0402C103K5RECAUTO; Value: 10000 pF; Applications: Automotive, ESD Protection; Capacitance: 10000 pF; componentlink1description: Datasheet; componentlink1url: https://api.kemet.com/component-edge/download/datasheet/C0402C103K5RECAUTO.pdf; componentlink2description: DigiKey Link; componentlink2url: https://www.digikey.com/en/products/detail/kemet/C0402C103K5RECAUTO/8646477; Device Package: 0402 (1005 Metric); lastupdated: 19/09/2022 12:56:43; Lifecycle Status: Active; Minimum Order: 1; Mounting Type: Surface Mount, MLCC; Operating Temperature: -55°C ~ 125°C; Package / Case: 0402 (1005 Metric); packaging: TapeAndReel; partid: 38916; Part Status: Active; price: 0.01; Ratings: AEC-Q200; series: ESD SMD Auto X7R; Size / Dimension: 0.039" L x 0.020" W (1.00mm x 0.50mm); Supplier 1: DigiKey; Supplier Part Number 1: 399-C0402C103K5RECAUTOCT-ND; Temperature Coefficient: X7R; Thickness (Max): 0.022" (0.55mm); Tolerance: ±10%; Voltage - Rated: 50V
FB7 FB8 = BLM15AG601SN1D: FERRITE BEAD 600 OHM 0402 1LN; Manufacturer: Murata Electronics; Current Rating (Max): 300mA; DC Resistance (DCR) (Max): 520mOhm; Number of Lines: 1; Part Number: BLM15AG601SN1D; ComponentLink1Description: Datasheet; ComponentLink1URL: https://www.murata.com/en-us/products/productdata/8796740059166/ENFA0018.pdf; ComponentLink2Description: DigiKey Link; ComponentLink2URL: https://www.digikey.com/en/products/detail/murata-electronics/BLM15AG601SN1D/584217; Device Package: 0402 (1005 Metric); Height (Max): 0.022" (0.55mm); Impedance @ Frequency: 600 Ohms @ 100 MHz; LastUpdated: 1/26/2023 08:43:34 PM; Lifecycle Status: Active; Minimum Order: 1; Mounting Type: Surface Mount; Operating Temperature: -55°C ~ 125°C; Package / Case: 0402 (1005 Metric); Packaging: TapeAndReel; PartId: 386; Part Status: Active; Price: 0.01; Series: EMIFIL®, BLM15; Size / Dimension: 0.039" L x 0.022" W (1.00mm x 0.55mm); Supplier 1: DigiKey; Supplier Part Number 1: 490-1006-1-ND; Value: 600 Ohms @ 100 MHz
R3 R45 = RC0402FR-0733RL: RES 33 OHM 1% 1/16W 0402; Manufacturer: Yageo; Power (Watts): 0.063W, 1/16W; Temperature Coefficient: ±100ppm/°C; Part Number: RC0402FR-0733RL; Value: 33 Ohms; ComponentLink1Description: Datasheet; ComponentLink1URL: https://www.yageo.com/upload/media/product/productsearch/datasheet/rchip/PYu-RC_Group_51_RoHS_L_10.pdf; ComponentLink2Description: DigiKey Link; ComponentLink2URL: https://www.digikey.com/en/products/detail/yageo/RC0402FR-0733RL/726593; Composition: Thick Film; Device Package: 0402 (1005 Metric); Features: Moisture Resistant; Height - Seated (Max): 0.016" (0.40mm); LastUpdated: 19/09/2022 13:14:04; Lifecycle Status: Active; Minimum Order: 1; Number of Terminations: 2; Operating Temperature: -55°C ~ 155°C; Package / Case: 0402 (1005 Metric); Packaging: CutTape; PartId: 20555; Part Status: Active; Price: 0.01; Resistance: 33 Ohms; Series: RC_L; Size / Dimension: 0.039" L x 0.020" W (1.00mm x 0.50mm); Supplier 1: DigiKey; Supplier Part Number 1: 311-33.0LRCT-ND; Supplier Device Package: 0402; Tolerance: ±1%
R66 R68 R69 = RP73PF1E10KBTD: as R1 on sheet CONFIGURATION_STORAGE_USER_LEDS_BUTTONS; Part Number: RP73PF1E10KBTD; Value: 10 kOhms; ComponentLink1Description: Datasheet; ComponentLink1URL: https://www.te.com/commerce/DocumentDelivery/DDEController?Action=srchrtrv&DocNm=1773272&DocType=DS&DocLang=English; ComponentLink2Description: DigiKey Link; ComponentLink2URL: https://www.digikey.com/en/products/detail/te-connectivity-passive-product/RP73PF1E10KBTD/8260957; Composition: Thin Film; Device Package: 0402 (1005 Metric); Height - Seated (Max): 0.014" (0.35mm); LastUpdated: 9/19/2022 01:15:04 PM; Lifecycle Status: Active; Minimum Order: 1; Number of Terminations: 2; Operating Temperature: -55°C ~ 155°C; Package / Case: 0402 (1005 Metric); Packaging: TapeAndReel; PartId: 2434; Part Status: Active; Price: 0.09; Resistance: 10 kOhms; Series: RP73, Holsworthy; Size / Dimension: 0.039" L x 0.020" W (1.00mm x 0.50mm); Supplier 1: DigiKey; Supplier Part Number 1: A127415CT-ND; Supplier Device Package: 0402; Tolerance: ±0.1%
R87 = RMCF0402FT12K0: RES 12K OHM 1% 1/16W 0402; Manufacturer: Stackpole Electronics Inc; Power (Watts): 0.063W, 1/16W; Temperature Coefficient: ±100ppm/°C; Part Number: RMCF0402FT12K0; Value: 12 kOhms; ComponentLink1Description: Datasheet; ComponentLink1URL: https://www.seielect.com/catalog/sei-rmcf_rmcp.pdf; ComponentLink2Description: DigiKey Link; ComponentLink2URL: https://www.digikey.com/en/products/detail/stackpole-electronics-inc/RMCF0402FT12K0/1714419; Composition: Thick Film; Device Package: 0402 (1005 Metric); Features: Automotive AEC-Q200; Height - Seated (Max): 0.016" (0.40mm); LastUpdated: 2/18/2023 08:21:51 PM; Lifecycle Status: Active; Minimum Order: 1; Number of Terminations: 2; Operating Temperature: -55°C ~ 155°C; Package / Case: 0402 (1005 Metric); Packaging: CutTape; PartId: 4499; Part Status: Active; Price: 0.01; Ratings: AEC-Q200; Resistance: 12 kOhms; Series: RMCF; Size / Dimension: 0.039" L x 0.020" W (1.00mm x 0.50mm); Supplier 1: DigiKey; Supplier Part Number 1: RMCF0402FT12K0CT-ND; Supplier Device Package: 0402; Tolerance: ±1%
U8 = T20Q144: as U8 on sheet CONFIGURATION_STORAGE_USER_LEDS_BUTTONS
Y4 = ASE-50.000MHZ-ET: XTAL OSC XO 50.0000MHZ CMOS SMD; Manufacturer: Abracon LLC; Base Resonator: Crystal; Current - Supply (Max): 19mA; Frequency Stability: ±100ppm; Function: Enable/Disable; Voltage - Supply: 3.3V; Part Number: ASE-50.000MHZ-ET; ComponentLink1Description: Datasheet; ComponentLink1URL: https://abracon.com/Oscillators/ASEseries.pdf; ComponentLink2Description: DigiKey Link; ComponentLink2URL: https://www.digikey.com/en/products/detail/abracon-llc/ASE-50-000MHZ-ET/2001363; Frequency: 50 MHz; Height - Seated (Max): 0.047" (1.20mm); LastUpdated: 1/25/2023 08:51:43 PM; Lifecycle Status: Active; Minimum Order: 1; Mounting Type: Surface Mount; Operating Temperature: -20°C ~ 70°C; Output: CMOS; Package / Case: 4-SMD, No Lead; Packaging: TapeAndReel; PartId: 115; Part Status: Active; Price: 0.70; Series: ASE; Size / Dimension: 0.126" L x 0.098" W (3.20mm x 2.50mm); Supplier 1: DigiKey; Supplier Part Number 1: 535-9996-1-ND; Type: XO (Standard); Value: 50 MHz
Y5 = ASE-33.333MHZ-LC-T: XTAL OSC XO 33.3330MHZ CMOS SMD; Manufacturer: Abracon LLC; Base Resonator: Crystal; Current - Supply (Max): 13mA; Frequency Stability: ±50ppm; Function: Enable/Disable; Voltage - Supply: 3.3V; Part Number: ASE-33.333MHZ-LC-T; ComponentLink1Description: Datasheet; ComponentLink1URL: https://abracon.com/Oscillators/ASEseries.pdf; ComponentLink2Description: DigiKey Link; ComponentLink2URL: https://www.digikey.com/en/products/detail/abracon-llc/ASE-33-333MHZ-LC-T/1236891; Frequency: 33.333 MHz; Height - Seated (Max): 0.047" (1.20mm); LastUpdated: 1/25/2023 08:51:43 PM; Lifecycle Status: Active; Minimum Order: 1; Mounting Type: Surface Mount; Operating Temperature: -40°C ~ 85°C; Output: CMOS; Package / Case: 4-SMD, No Lead; Packaging: TapeAndReel; PartId: 128; Part Status: Active; Price: 0.76; Series: ASE; Size / Dimension: 0.126" L x 0.098" W (3.20mm x 2.50mm); Supplier 1: DigiKey; Supplier Part Number 1: 535-9574-1-ND; Type: XO (Standard); Value: 33.333 MHz

## Nets that join several sheets
3V3: POWER (30 pins), FTDI_USB (24 pins), USB_OTG (6 pins), ETHERNET (12 pins), ESP32 (10 pins), CONFIGURATION_STORAGE_USER_LEDS_BUTTONS (29 pins), FPGA_GPIO (7 pins)
5V: POWER (10 pins), FTDI_USB (C12.2 C13.2 FB2.2), USB_OTG (C52.2 U6.6), ESP32 (C113.2 J5.2 J7.2 J7.4)
GND: POWER (80 pins), FTDI_USB (36 pins), USB_OTG (18 pins), ETHERNET (25 pins), ESP32 (55 pins), CONFIGURATION_STORAGE_USER_LEDS_BUTTONS (22 pins), FPGA_GPIO (9 pins)
LVDS_VIO: POWER (15 pins), ESP32 (C114.1 J5.39)
VBUS: POWER (TP6.1), FTDI_USB (C11.2 D12.C FB2.1 IC1.3)
BTN1: CONFIGURATION_STORAGE_USER_LEDS_BUTTONS (C24.2 R5.1 S2.2), FPGA_GPIO (U8.135)
BTN2: CONFIGURATION_STORAGE_USER_LEDS_BUTTONS (C25.2 R8.1 S3.2), FPGA_GPIO (U8.141)
C_DONE: FTDI_USB (U1.18), CONFIGURATION_STORAGE_USER_LEDS_BUTTONS (R29.1 R44.1 U8.34)
C_RESET: FTDI_USB (U1.17), CONFIGURATION_STORAGE_USER_LEDS_BUTTONS (C23.2 R1.1 S1.2 U8.35)
CPEN: USB_OTG (U6.4), FPGA_GPIO (U8.92)
ESP_CLK: ESP32 (R101.1), FPGA_GPIO (U8.18)
ESP_CS: ESP32 (R100.2), FPGA_GPIO (U8.19)
ESP_DTR: FTDI_USB (U1.49), ESP32 (IC8.2 R85.2)
ESP_MISO: ESP32 (R99.1), FPGA_GPIO (U8.20)
ESP_MOSI: ESP32 (R98.2), FPGA_GPIO (U8.17)
ESP_RTS: FTDI_USB (U1.47), ESP32 (IC7.2 R86.2)
ESP_RXD: FTDI_USB (U1.42), ESP32 (U3.30)
ESP_TXD: FTDI_USB (U1.46), ESP32 (U3.31)
ETH_MDC: ETHERNET (U5.22), FPGA_GPIO (U8.6)
ETH_MDI_O: ETHERNET (R65.2 U5.23), FPGA_GPIO (U8.4)
GPIOB_CLK0_N: ESP32 (J5.35), FPGA_GPIO (U8.72)
GPIOB_CLK0_P: ESP32 (J5.33), FPGA_GPIO (U8.71)
GPIOB_RX00_N: ESP32 (J5.3), FPGA_GPIO (U8.56)
GPIOB_RX00_P: ESP32 (J5.1), FPGA_GPIO (U8.55)
GPIOB_RX03_N: ESP32 (J5.7), FPGA_GPIO (U8.60)
GPIOB_RX03_P: ESP32 (J5.5), FPGA_GPIO (U8.61)
GPIOB_RX07_N: ESP32 (J5.11), FPGA_GPIO (U8.65)
GPIOB_RX07_P: ESP32 (J5.9), FPGA_GPIO (U8.66)
GPIOB_RX10_N: ESP32 (J5.15), FPGA_GPIO (U8.68)
GPIOB_RX10_P: ESP32 (J5.13), FPGA_GPIO (U8.67)
GPIOB_RX12_EXTFB0_N: ESP32 (J5.19), FPGA_GPIO (U8.69)
GPIOB_RX12_EXTFB0_P: ESP32 (J5.17), FPGA_GPIO (U8.70)
GPIOB_TX00_N: ESP32 (J5.8), FPGA_GPIO (U8.39)
GPIOB_TX00_P: ESP32 (J5.6), FPGA_GPIO (U8.38)
GPIOB_TX02_N: ESP32 (J5.12), FPGA_GPIO (U8.41)
GPIOB_TX02_P: ESP32 (J5.10), FPGA_GPIO (U8.40)
GPIOB_TX04_N: ESP32 (J5.16), FPGA_GPIO (U8.43)
GPIOB_TX04_P: ESP32 (J5.14), FPGA_GPIO (U8.42)
GPIOB_TX06_N: ESP32 (J5.20), FPGA_GPIO (U8.46)
GPIOB_TX06_P: ESP32 (J5.18), FPGA_GPIO (U8.45)
GPIOB_TX09_N: ESP32 (J5.36), FPGA_GPIO (U8.48)
GPIOB_TX09_P: ESP32 (J5.34), FPGA_GPIO (U8.47)
HOLD: FTDI_USB (U1.19), CONFIGURATION_STORAGE_USER_LEDS_BUTTONS (IC3.7 R20.1)
LED3_A: CONFIGURATION_STORAGE_USER_LEDS_BUTTONS (R61.1), FPGA_GPIO (U8.139)
LED4_A: CONFIGURATION_STORAGE_USER_LEDS_BUTTONS (R64.1), FPGA_GPIO (U8.144)
NSTATUS: CONFIGURATION_STORAGE_USER_LEDS_BUTTONS (R60.1), FPGA_GPIO (U8.136)
OTG_FLAG: USB_OTG (U6.3), FPGA_GPIO (U8.93)
OTG_RESETB: USB_OTG (U4.22), FPGA_GPIO (U8.112)
RMII_CRS_DV: ETHERNET (R92.1), FPGA_GPIO (U8.3)
RMII_REF_CLK: ETHERNET (R96.1), FPGA_GPIO (U8.11)
RMII_RX_0: ETHERNET (R93.1), FPGA_GPIO (U8.14)
RMII_RX_1: ETHERNET (R94.1), FPGA_GPIO (U8.15)
RMII_TX_0: ETHERNET (R95.1), FPGA_GPIO (U8.8)
RMII_TX_1: ETHERNET (R97.1), FPGA_GPIO (U8.10)
RMII_TXEN: ETHERNET (R91.1), FPGA_GPIO (U8.7)
RXD: FTDI_USB (U1.32), FPGA_GPIO (U8.142)
~{SD_CS}: CONFIGURATION_STORAGE_USER_LEDS_BUTTONS (J2.2 R59.1), FPGA_GPIO (U8.86)
~{SD_DET}: CONFIGURATION_STORAGE_USER_LEDS_BUTTONS (R10.1 R62.1), FPGA_GPIO (U8.81)
SD_DI: CONFIGURATION_STORAGE_USER_LEDS_BUTTONS (J2.3 R43.1), FPGA_GPIO (U8.84)
SD_DO: CONFIGURATION_STORAGE_USER_LEDS_BUTTONS (J2.7 R58.1), FPGA_GPIO (U8.82)
SD_SCLK: CONFIGURATION_STORAGE_USER_LEDS_BUTTONS (J2.5 R9.1), FPGA_GPIO (U8.83)
SFLASH_PWR: FTDI_USB (U1.52), CONFIGURATION_STORAGE_USER_LEDS_BUTTONS (R30.2)
SPI_MISO: FTDI_USB (U1.14), CONFIGURATION_STORAGE_USER_LEDS_BUTTONS (IC3.2 R23.1 U8.28)
SPI_MOSI: FTDI_USB (U1.13), CONFIGURATION_STORAGE_USER_LEDS_BUTTONS (IC3.5 R24.1 U8.29)
SPI_SCLK: FTDI_USB (U1.12), CONFIGURATION_STORAGE_USER_LEDS_BUTTONS (IC3.6 R28.1 U8.30)
SPI_SS: FTDI_USB (U1.15), CONFIGURATION_STORAGE_USER_LEDS_BUTTONS (IC3.1 R38.1 U8.31)
TCK: FTDI_USB (U1.22), CONFIGURATION_STORAGE_USER_LEDS_BUTTONS (R40.1 TP2.1 U8.26)
TDI: FTDI_USB (U1.23), CONFIGURATION_STORAGE_USER_LEDS_BUTTONS (R39.1 TP1.1 U8.27)
TDO: FTDI_USB (U1.24), CONFIGURATION_STORAGE_USER_LEDS_BUTTONS (R42.1 TP4.1 U8.24)
TEST_N: CONFIGURATION_STORAGE_USER_LEDS_BUTTONS (R63.1), FPGA_GPIO (U8.74)
TMS: FTDI_USB (U1.25), CONFIGURATION_STORAGE_USER_LEDS_BUTTONS (R41.1 TP3.1 U8.25)
TXD: FTDI_USB (U1.33), FPGA_GPIO (U8.140)
ULPI_CLKOUT: USB_OTG (U4.2), FPGA_GPIO (U8.97)
ULPI_DATA0: USB_OTG (U4.4), FPGA_GPIO (U8.106)
ULPI_DATA1: USB_OTG (U4.5), FPGA_GPIO (U8.105)
ULPI_DATA2: USB_OTG (U4.6), FPGA_GPIO (U8.103)
ULPI_DATA3: USB_OTG (U4.7), FPGA_GPIO (U8.102)
ULPI_DATA4: USB_OTG (U4.8), FPGA_GPIO (U8.101)
ULPI_DATA5: USB_OTG (U4.10), FPGA_GPIO (U8.100)
ULPI_DATA6: USB_OTG (U4.11), FPGA_GPIO (U8.99)
ULPI_DATA7: USB_OTG (U4.12), FPGA_GPIO (U8.98)
ULPI_DIR: USB_OTG (U4.1), FPGA_GPIO (U8.110)
ULPI_NXT: USB_OTG (U4.3), FPGA_GPIO (U8.109)
ULPI_STP: USB_OTG (U4.24), FPGA_GPIO (U8.111)
VCON_1V8: POWER (R54.1), FTDI_USB (U1.34)
VCON_2V5: POWER (R84.1), FTDI_USB (U1.35)